# EAGLE design controller (EAGLE 7.5.0)
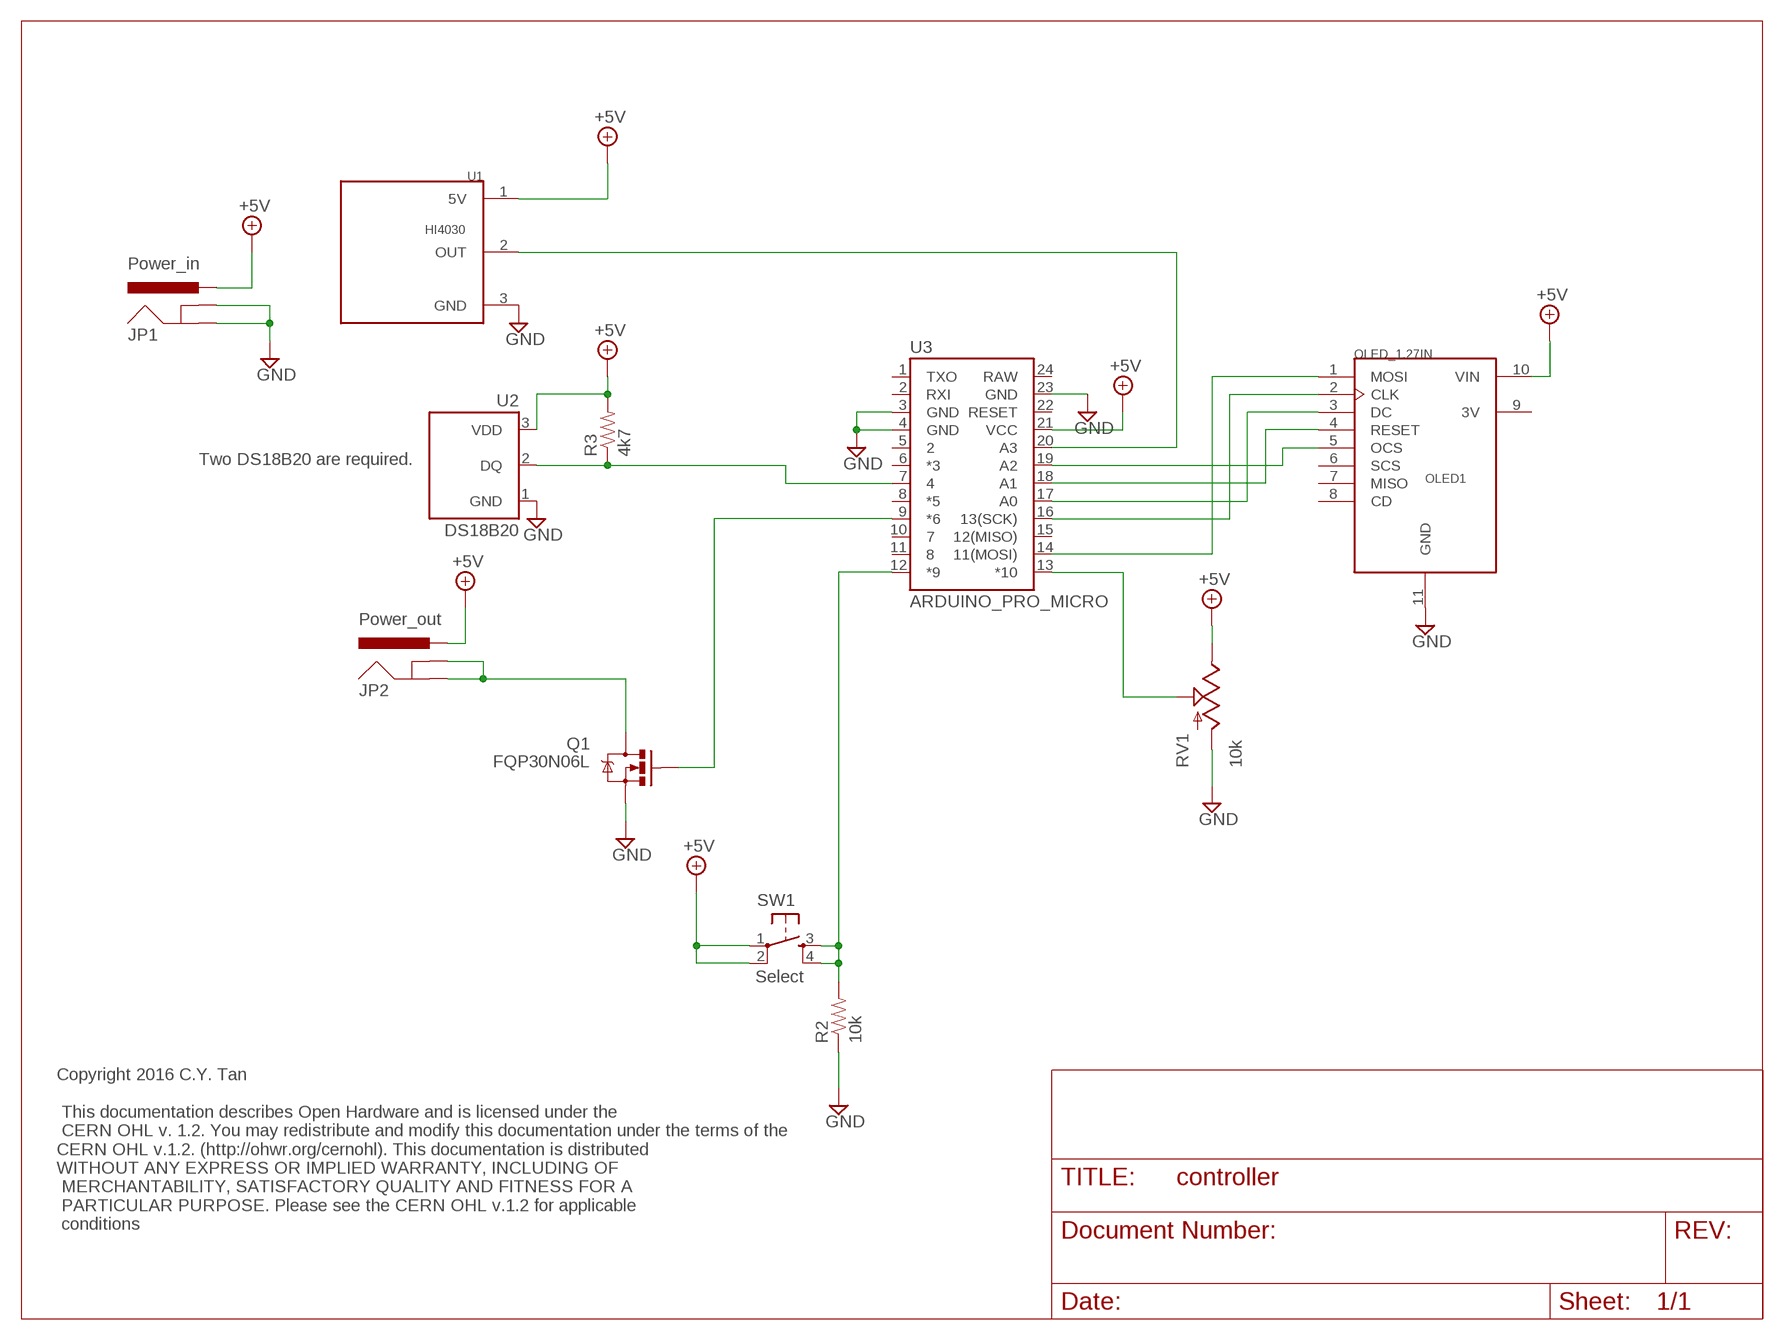
[diagram p0: schematic, sheet 1]

## Parts
JP1  Power_in  POWER_JACKPTH  [POWER_JACK_PTH]
JP2  Power_out  POWER_JACKPTH  [POWER_JACK_PTH]
OLED1  OLED_1.27IN  [OLED_1.27INCH]
Q1  FQP30N06L  MOSFET-NCHANNELFQP30N06L  [TO220V]
R2  10k  RESISTORAXIAL-0.3  [AXIAL-0.3]
R3  4k7  RESISTORAXIAL-0.3  [AXIAL-0.3]
RV1  10k  POTALPS-KIT  [ALPS_POT_KIT]
SW1  Select  TACTILE-SWITCH-PTH  [TAC-SWITCH-PTH]
U1  HI4030  HUMIDITY_SENSOR  [1X03]
U2  DS18B20  [TO-92-AMMO]
U3  ARDUINO_PRO_MICRO  [ARDUINO_PRO_MICRO]

## Nets
+5V: JP1.PWR JP2.PWR OLED1.10(VIN) R3.P$2 RV1.P$1(E) SW1.1 SW1.2 U1.1(5V) U2.3(VDD) U3.21(VCC)
GND: JP1.GND JP1.GNDBREAK OLED1.11(GND) Q1.3(S) R2.P$1 RV1.P$3(A) U1.3(GND) U2.1(GND) U3.3(GND) U3.4(GND) U3.23(GND)
N$1: OLED1.1(MOSI) U3.14(11(MOSI))
N$2: OLED1.2(CLK) U3.16(13(SCK))
N$3: OLED1.3(DC) U3.17(A0)
N$4: JP2.GND JP2.GNDBREAK Q1.2(D)
N$5: OLED1.4(RESET) U3.18(A1)
N$6: OLED1.5(OCS) U3.19(A2)
N$7: Q1.1(G) U3.9(*6)
N$8: RV1.P$2(S) U3.13(*10)
N$9: R2.P$2 SW1.3 SW1.4 U3.12(*9)
N$10: U1.2(OUT) U3.20(A3)
N$11: R3.P$1 U2.2(DQ) U3.7
Unconnected: OLED1.6(SCS) OLED1.7(MISO) OLED1.8(CD) U3.1(TXO) U3.2(RXI) U3.5 U3.6(*3) U3.8(*5) U3.10 U3.11 U3.15(12(MISO)) U3.22(RESET) U3.24(RAW)

## Notes on the sheet
- Two DS18B20 are required.
- Copyright 2016 C.Y. Tan
  
   This documentation describes Open Hardware and is licensed under the
   CERN OHL v. 1.2. You may redistribute and modify this documentation under the terms of the 
  CERN OHL v.1.2. (http://ohwr.org/cernohl). This documentation is distributed 
  WITHOUT ANY EXPRESS OR IMPLIED WARRANTY, INCLUDING OF
   MERCHANTABILITY, SATISFACTORY QUALITY AND FITNESS FOR A
   PARTICULAR PURPOSE. Please see the CERN OHL v.1.2 for applicable
   conditions

## Power pins joined to a net without a drawn wire
3V: OLED1.9(3V)

## Library data of the parts
JP1 JP2 = SparkFun-Connectors:POWER_JACK: Power Jack This is the standard 5.5mm barrel jack for power. The PTH is the most common, proven, reliable, footprint. The Slot footprint only works if the mill layer is transmitted to the PCB fab house so be warned. Mating wall wart : TOL-00298 (and others); PROD_ID: CONN-08197
OLED1 = cytan:OLED_1.27IN: Adafruit 1.27inch breakout board
Q1 = SparkFun-DiscreteSemi:MOSFET-NCHANNEL: Common NMOSFET Parts MFG P/N Store ID Prod ID FDD8780 TRANS-09984 SI7820DN TRANS-11055 FDS6630A IC-08089 2N7002PW TRANS-11151 FQP30N06L COM-10213 TRANS-10060 BSS123LT1G TRANS-08345 BSS138 TRANS-00830 BS170 2N7000; PROD_ID: TRANS-10060
R2 R3 = SparkFun-Resistors:RESISTOR: Resistor Basic schematic elements and footprints for 0603, 1206, and PTH resistors.
RV1 = SparkFun-Electromechanical:POT; PROD_ID: RES-09177
SW1 = GeekAmmo:TACTILE-SWITCH: Tactile Switch 4 Pins, SPST NO
U1 = cytan:HUMIDITY_SENSOR: Humidity Sensor (HIH-4030)
U2 = SparkFun-Sensors:DS18B20: Dallas/Maxim DS18B20 1-wire temperature sensor Datasheet: http://datasheets.maximintegrated.com/en/ds/DS18B20.pdf temp thermometer 1-wire one-wire one wire; STORE_ID: SEN-00245
U3 = SparkFun-Boards:ARDUINO_PRO_MICRO

## Board
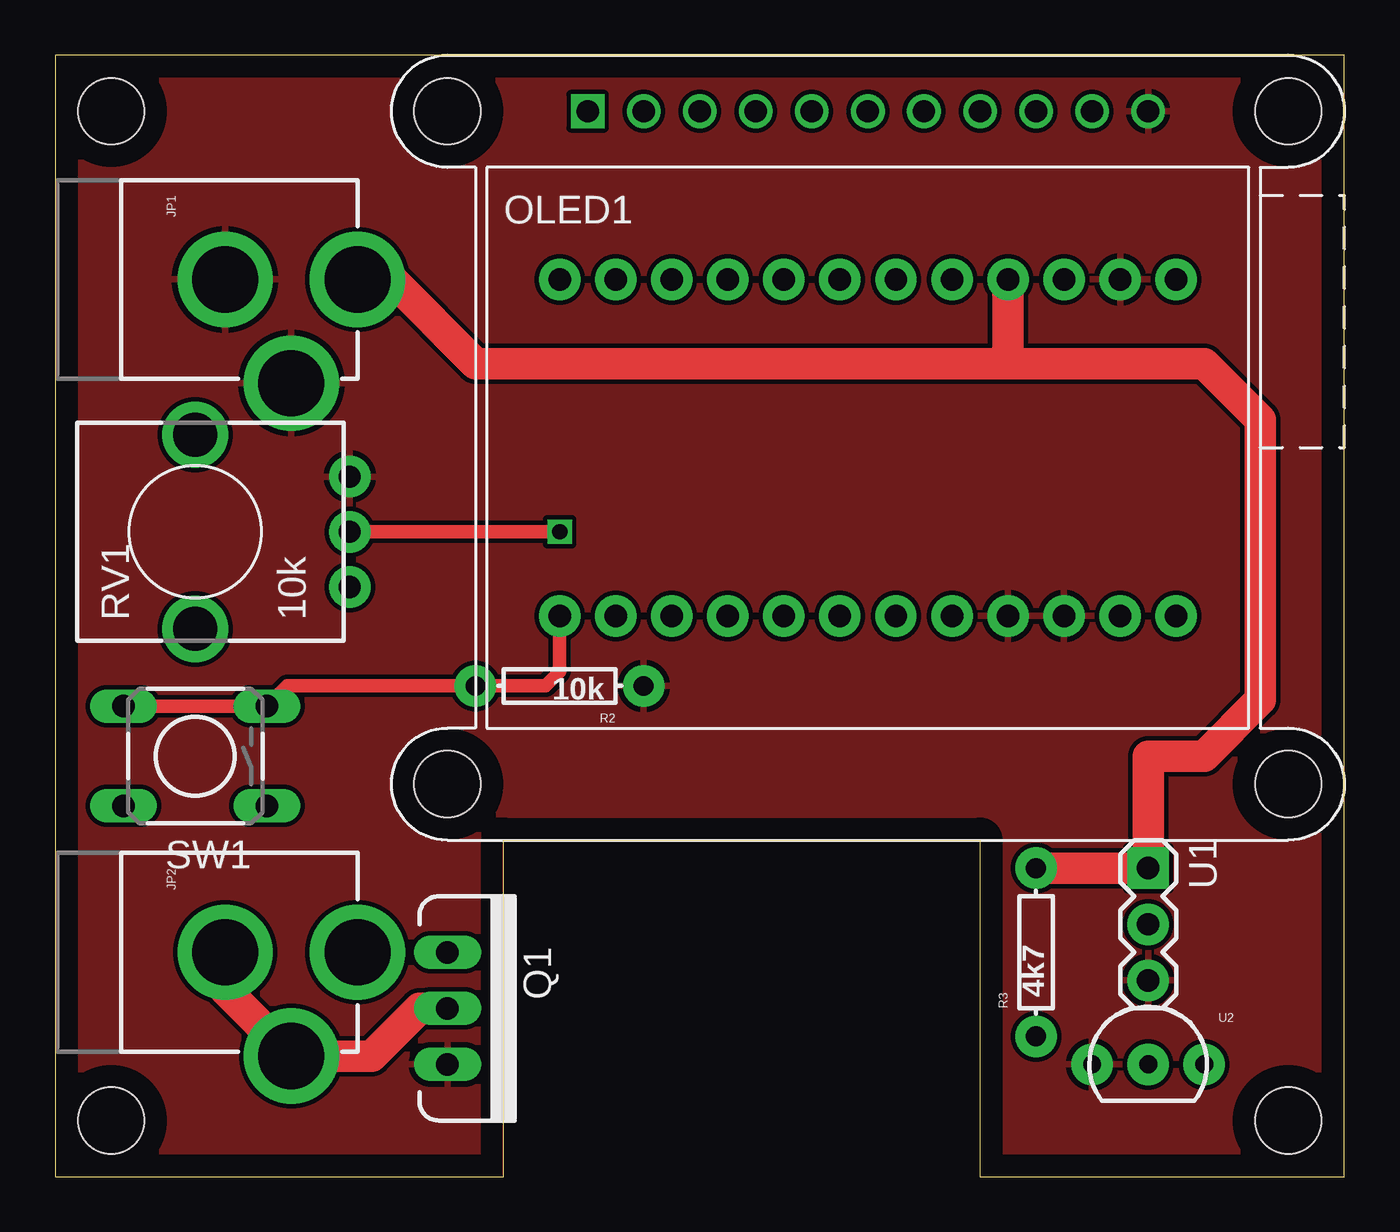
[diagram p1: board, top side]
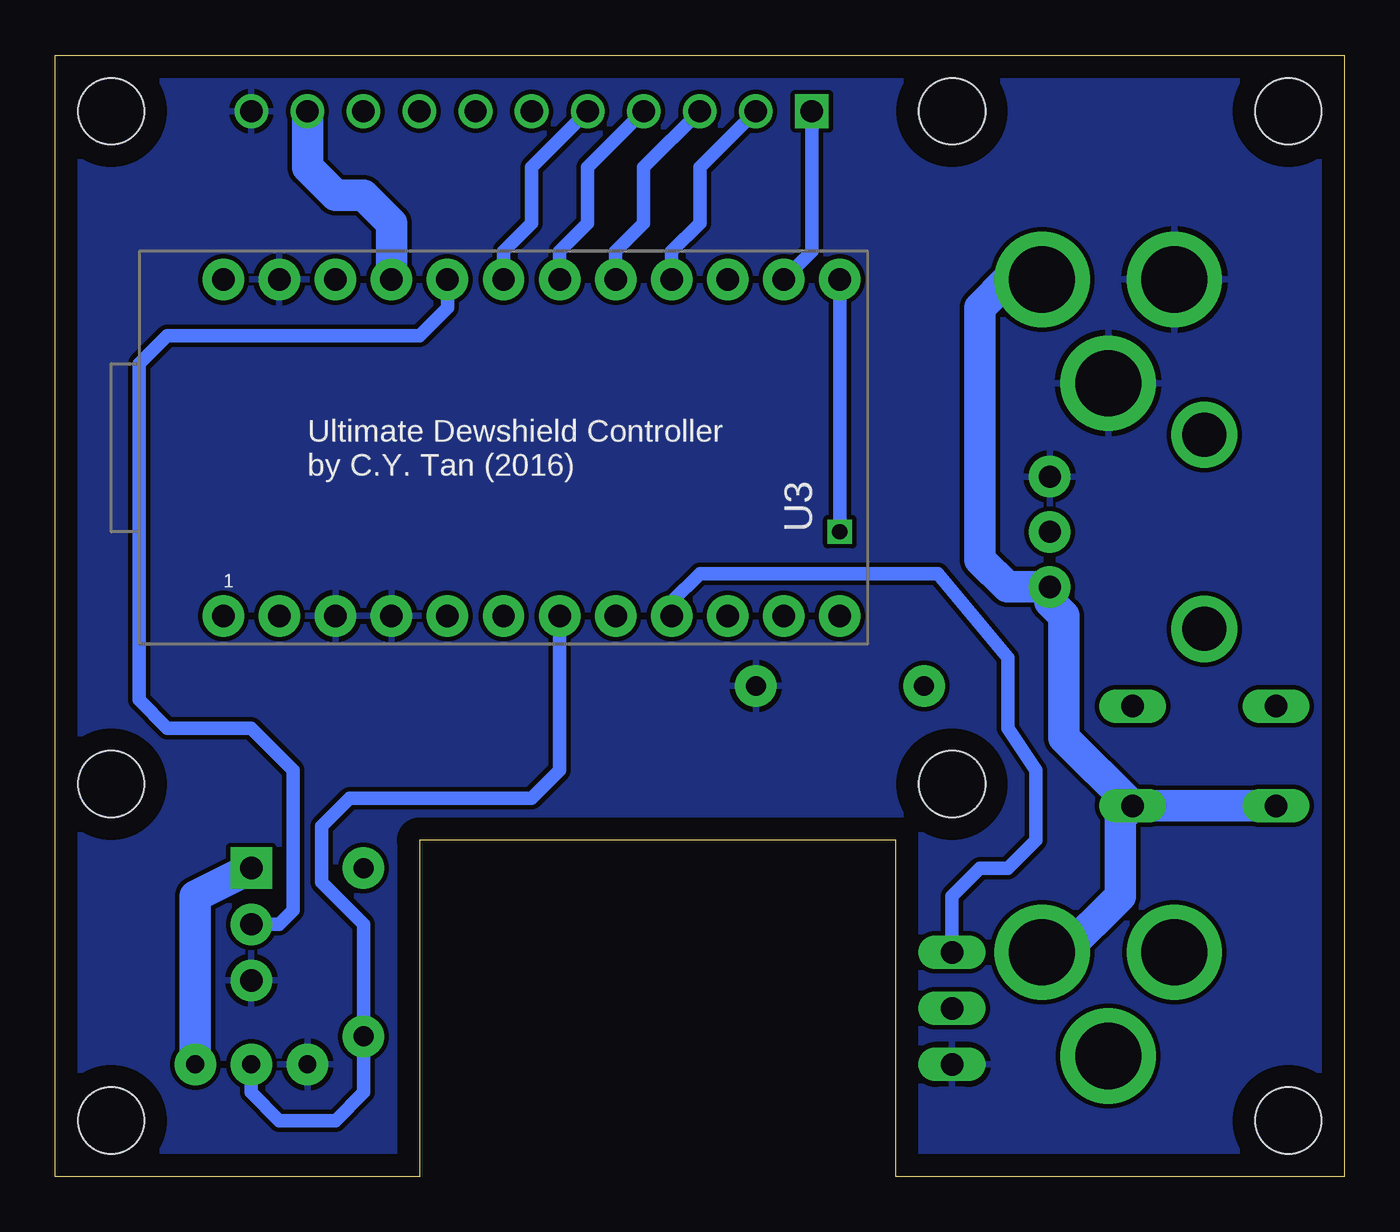
[diagram p2: board, bottom side, seen from below]

Size 58.42 x 50.8 mm. Coordinates in mm from the lower left corner, seen from the top.
Outline: 0,0 20.32,0 20.32,15.24 41.91,15.24 41.91,0 58.42,0 58.42,50.8 0,50.8 0,0
Copper layers (1*16): Top 0.035mm / dielectric 1.5mm / Bottom 0.035mm
Design rules "default": minimum track width 10mil, minimum drill 24mil, track to track 8mil, track to pad 8mil, pad to pad 8mil, via to via 8mil, smd to smd 8mil, copper to edge 40mil, drill to drill 8mil, minimum pad ring 10mil, minimum via ring 8mil, stop-mask expansion 4mil, vias tented up to drill 0mil, thermal gap 10mil
Holes 3 mm at 2.54,48.26 2.54,2.54 55.88,2.54
Milling: 8 lines

### Footprints (pad centres in the part's own frame; a part is rotated, then mirrored left to right if it is on the bottom)
POWER_JACK_PTH = drill 2.997 pad 4.318: GND 0,7.7; GNDBREAK 4.7,10.7; PWR 0,13.7
OLED_1.27INCH = drill 1.016 square: 1 0,0 | drill 1.016: 2 2.54,0; 3 5.08,0; 4 7.62,0; 5 10.16,0; 6 12.7,0; 7 15.24,0; 8 17.78,0; 9 20.32,0; 10 22.86,0; 11 25.4,0 | hole 2.997: -6.35,-30.48; -6.35,0; 31.75,0; 31.75,-30.48
TO220V = drill 1.016 long: 1 -2.54,0; 2 0,0; 3 2.54,0
AXIAL-0.3 = drill 0.9 pad 1.88: P$1 -3.81,0; P$2 3.81,0
ALPS_POT_KIT = drill 1 pad 1.88: P$1 7,-2.5; P$2 7,0; P$3 7,2.5 | drill 2: P$4 0,-4.4; P$5 0,4.4
TAC-SWITCH-PTH = drill 1.016 pad 1.524 long: 1 -3.251,2.261; 2 3.251,2.261; 3 -3.251,-2.261; 4 3.251,-2.261
1X03 = drill 1.016 pad 1.88 square: 1 0,0 | drill 1.016 pad 1.88: 2 2.54,0; 3 5.08,0
TO-92-AMMO = drill 0.813 pad 1.88: 1 -2.54,0; 2 0,0; 3 2.54,0
ARDUINO_PRO_MICRO = drill 1.016 pad 1.88: 1 -7.62,12.7; 2 -7.62,10.16; 3 -7.62,7.62; 4 -7.62,5.08; 5 -7.62,2.54; 6 -7.62,0; 7 -7.62,-2.54; 8 -7.62,-5.08; 9 -7.62,-7.62; 10 -7.62,-10.16; 11 -7.62,-12.7; 12 -7.62,-15.24; 13 7.62,-15.24; 14 7.62,-12.7; 15 7.62,-10.16; 16 7.62,-7.62; 17 7.62,-5.08; 18 7.62,-2.54; 19 7.62,0; 20 7.62,2.54; 21 7.62,5.08; 22 7.62,7.62; 23 7.62,10.16; 24 7.62,12.7

### Placement (x,y rotation side)
JP1  0,40.64 270 top
JP2  0,10.16 270 top
OLED1  24.13,48.26 0 top
Q1  17.78,7.62 270 top
R2  22.86,22.23 180 top
R3  44.45,10.16 90 top
RV1  6.35,29.21 0 top
SW1  6.35,19.05 180 top
U1  49.53,13.97 270 top
U2  49.53,5.08 0 top
U3  38.1,33.02 90 bottom

### Tracks (layer width: path | path; a pad name or v marks a point on that pad's centre or on a via)
+5V
  Top 1.422: U3.21 43.18,36.83 | 43.18,36.83 52.07,36.83 54.61,34.29 54.61,21.59 52.07,19.05 49.53,19.05 U1.1 R3.P$2 | 43.18,36.83 19.05,36.83 15.24,40.64 JP1.PWR
  Bottom 1.422: SW1.1 SW1.2 | OLED1.10 46.99,45.72 45.72,44.45 44.45,44.45 43.18,43.18 U3.21 | JP1.PWR 15.24,40.64 16.51,39.37 16.51,27.94 15.28,26.71 RV1.P$1 13.35,26.05 12.7,25.4 12.7,19.89 SW1.1 | U1.1 52.07,12.7 U2.3 | 13.35,10.16 JP2.PWR 12.7,10.16 10.16,12.7 10.16,16.23 SW1.1
GND
  pour Bottom: 0,50.8 0,0 20.32,0 20.32,15.24 41.91,15.24 41.91,0 58.42,0 58.42,50.8
  pour Top: 0,50.8 0,0 20.32,0 20.32,15.24 41.91,15.24 41.91,0 58.42,0 58.42,50.8
N$1
  Bottom 0.61: OLED1.1 24.13,41.91 U3.14
N$2
  Bottom 0.61: OLED1.2 29.21,45.72 29.21,43.18 30.48,41.91 U3.16
N$3
  Bottom 0.61: OLED1.3 31.75,45.72 31.75,43.18 33.02,41.91 U3.17
N$4
  Top 1.422: Q1.2 16.51,7.62 14.35,5.46 JP2.GNDBREAK 7.7,8.46 JP2.GND
N$5
  Bottom 0.61: OLED1.4 34.29,45.72 34.29,43.18 35.56,41.91 U3.18
N$6
  Bottom 0.61: OLED1.5 36.83,45.72 36.83,43.18 38.1,41.91 U3.19
N$7
  Bottom 0.61: Q1.1 17.78,12.7 16.51,13.97 15.24,13.97 13.97,15.24 13.97,18.41 15.24,20.32 15.24,23.5 18.41,27.3 29.21,27.3 30.48,26.04 U3.9
N$8  (via drill 0.7)
  Top 0.61: RV1.P$2 v22.86,29.21
  Bottom 0.61: U3.13 v22.86,29.21
N$9
  Top 0.61: U3.12 22.86,22.86 22.23,22.23 R2.P$2 10.52,22.23 SW1.3 SW1.4
N$10
  Bottom 0.61: U1.2 48.26,11.43 47.62,12.06 47.62,18.41 49.53,20.32 53.34,20.32 54.61,21.59 54.61,36.83 53.34,38.1 41.91,38.1 40.64,39.37 U3.20
N$11
  Bottom 0.61: U2.2 49.53,3.81 48.26,2.54 45.72,2.54 44.45,3.81 R3.P$1 44.45,11.43 46.35,13.34 46.35,15.88 45.09,17.14 36.83,17.14 35.56,18.41 U3.7

### Text on the board
bNames: Ultimate Dewshield Controller / by C.Y. Tan (2016) | 1